# Altium schematic sheet AGV_Schematic.SchDoc
size A3
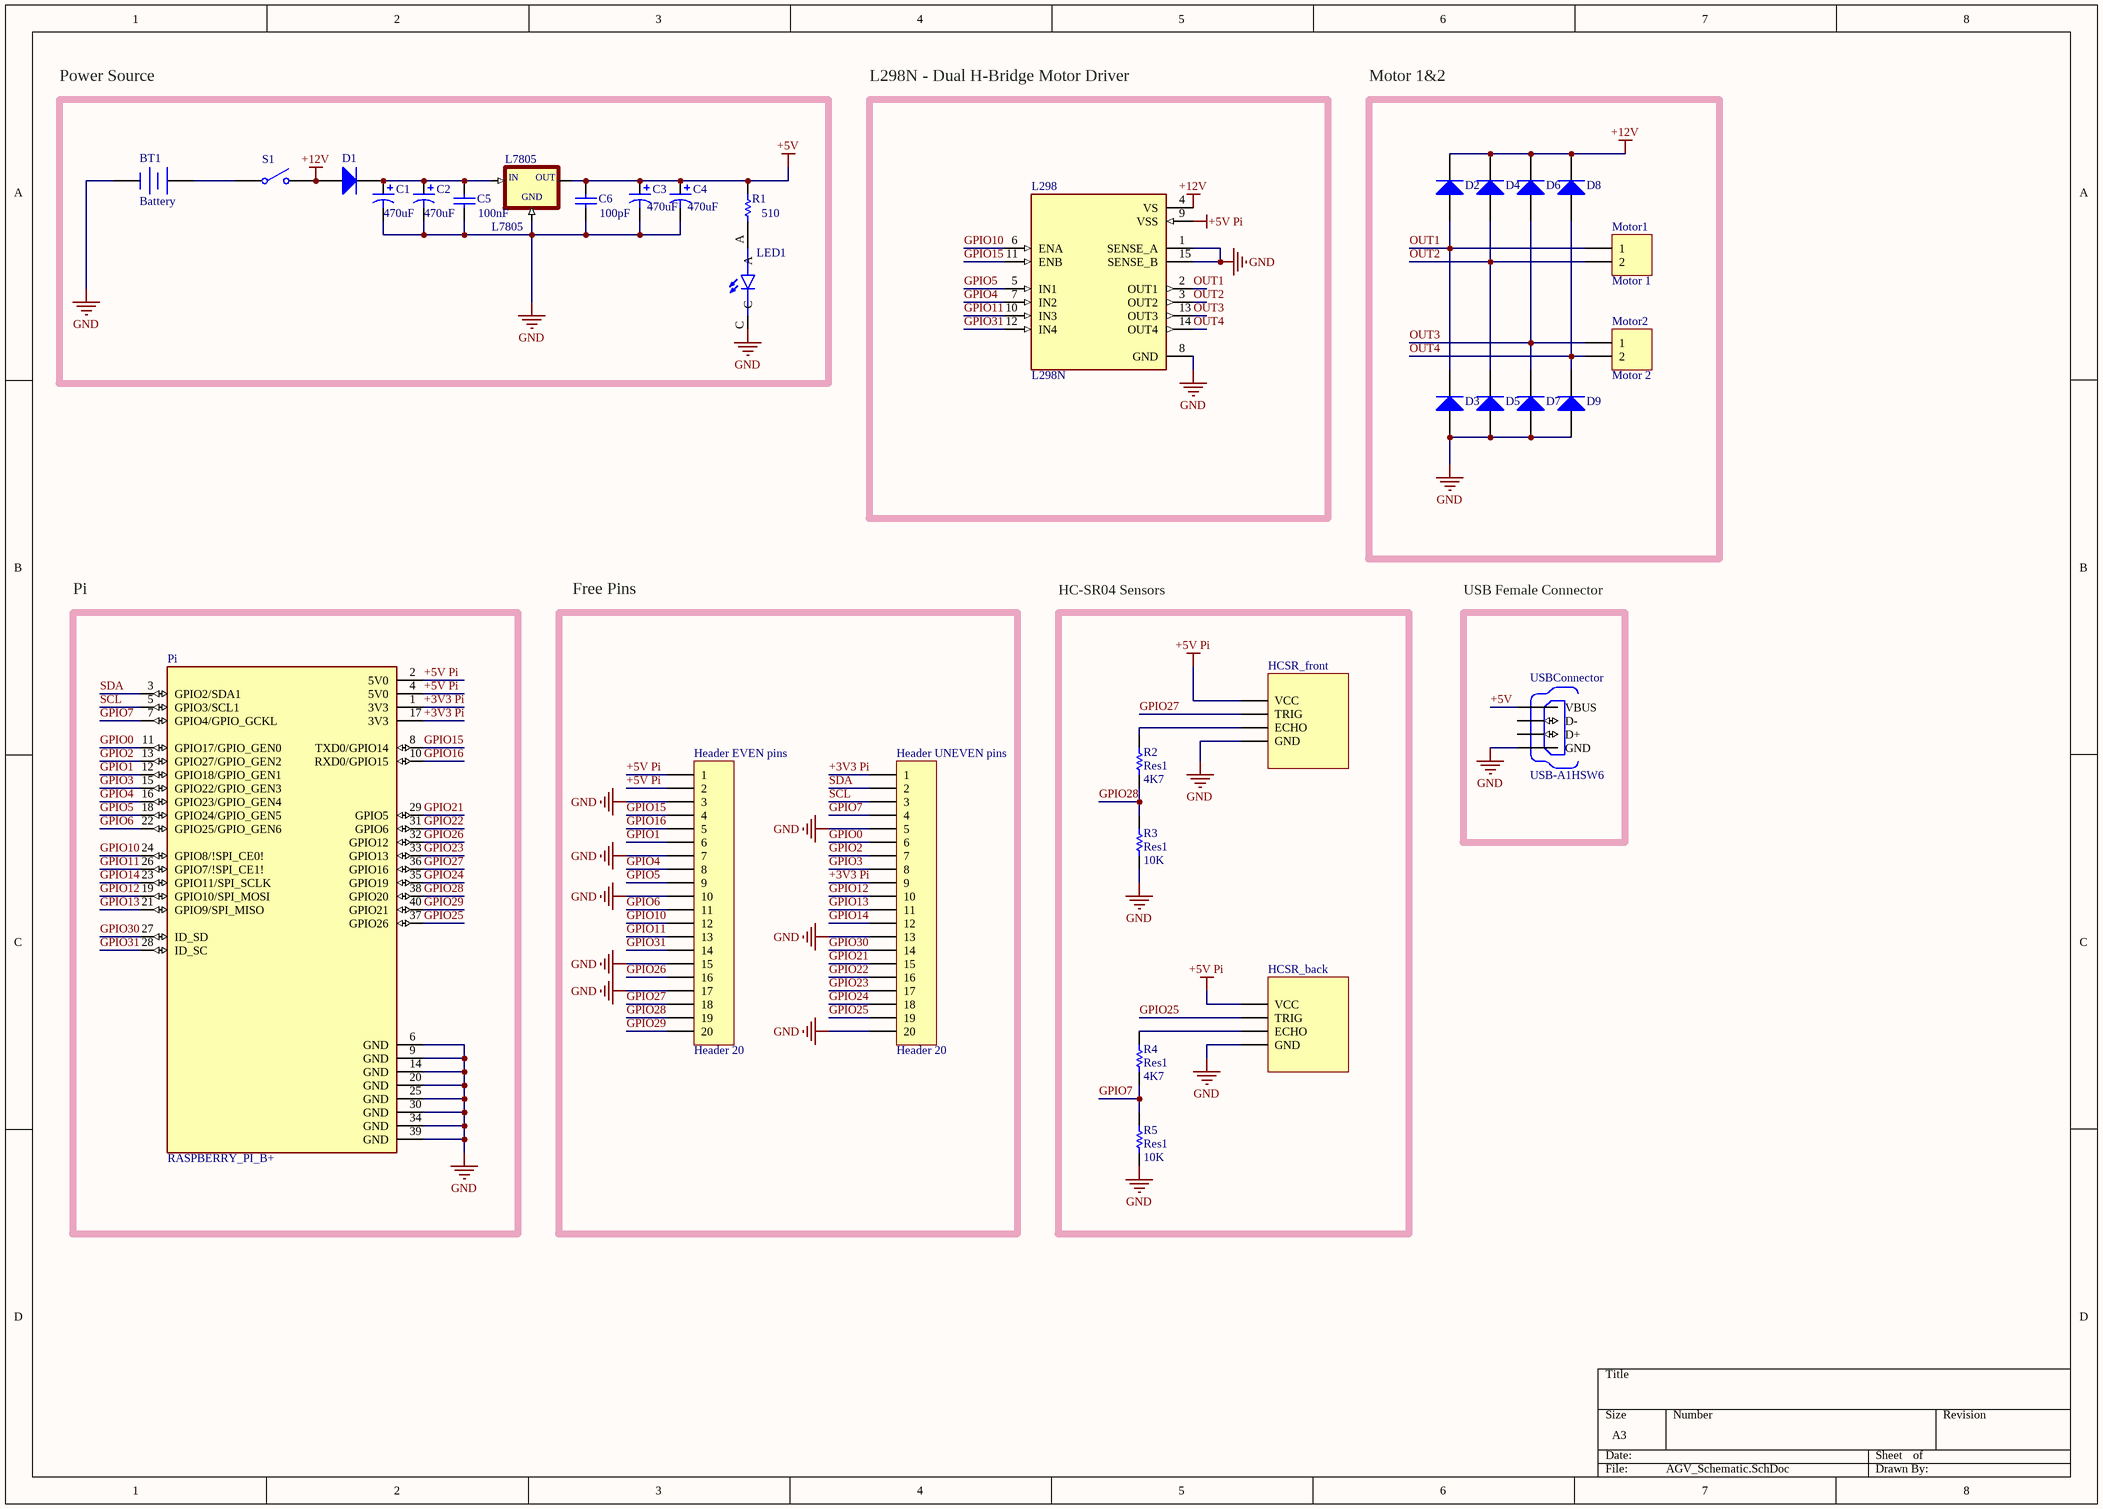
[diagram p0: AGV_Schematic.SchDoc]

## Parts
BT1  Battery  [PCBComponent_1]
C1  value 470uF  [Elektrolitski kondenzator]  (hidden comment: Cap Pol1)
C2  value 470uF  [Elektrolitski kondenzator]  (hidden comment: Cap Pol1)
C3  value 470uF  [Elektrolitski kondenzator]  (hidden comment: Cap Pol1)
C4  value 470uF  [Elektrolitski kondenzator]  (hidden comment: Cap Pol1)
C5  value 100nF  [CAP140]  (hidden comment: Cap)
C6  value 100pF  [CAP140]  (hidden comment: Cap)
D1  Diode 1N4007  [DO-41]  (value not drawn)
D2  Diode 1N5402  [DO-41]  (value not drawn)
D3  Diode 1N5402  [DO-41]  (value not drawn)
D4  Diode 1N5402  [DO-41]  (value not drawn)
D5  Diode 1N5402  [DO-41]  (value not drawn)
D6  Diode 1N5402  [DO-41]  (value not drawn)
D7  Diode 1N5402  [DO-41]  (value not drawn)
D8  Diode 1N5402  [DO-41]  (value not drawn)
D9  Diode 1N5402  [DO-41]  (value not drawn)
HCSR_back  (no value)  [HDR1X4]
HCSR_front  (no value)  [HDR1X4]
Header_EVEN_pins  Header 20  [HDR1X20]
Header_UNEVEN_pins  Header 20  [HDR1X20]
L298  L298N  [TO127P2020X500X2100-15]
L7805  L7805  [78XXS]
LED1  *  [LED_WP7113LGD]  (value not drawn)
Motor1  Motor 1  [PCBComponent_1]
Motor2  Motor 2  [PCBComponent_1]
Pi  RASPBERRY_PI_B+  [PiMirror]
R1  value 510  [AXIAL-0.3]  (hidden comment: Res1)
R2  Res1  value 4K7  [AXIAL-0.3]
R3  Res1  value 10K  [AXIAL-0.3]
R4  Res1  value 4K7  [AXIAL-0.3]
R5  Res1  value 10K  [AXIAL-0.3]
S1  SW-SPST  [Prekidac]  (value not drawn)
USBConnector  USB-A1HSW6  [OST_USB-A1HSW6]

## Blocks framed on the sheet
Power Source: BT1 C1-C6 D1 L7805 LED1 R1 S1
L298N - Dual H-Bridge Motor Driver: L298
Motor 1&2: D2-D9 Motor1 Motor2
Pi: Pi
Free Pins: Header_EVEN_pins Header_UNEVEN_pins
HC-SR04 Sensors: HCSR_back HCSR_front R2-R5
USB Female Connector: USBConnector

## Nets
+5V: C3.1 C4.1 C6.2 L7805.OUT R1.2 USBConnector.1(VBUS)
+5V Pi: HCSR_back.1(VCC) HCSR_front.1(VCC) Header_EVEN_pins.1 Header_EVEN_pins.2 L298.9(VSS) Pi.2(5V0) Pi.4(5V0)
+12V: D1.1(A) D2.2(K) D4.2(K) D6.2(K) D8.2(K) L298.4(VS) S1.2(NO)
GND: BT1.2(-) C1.2 C2.2 C3.2 C4.2 C5.1 C6.1 D3.1(A) D5.1(A) D7.1(A) D9.1(A) HCSR_back.4(GND) HCSR_front.4(GND) Header_EVEN_pins.3 Header_EVEN_pins.7 Header_EVEN_pins.10 Header_EVEN_pins.15 Header_EVEN_pins.17 Header_UNEVEN_pins.5 Header_UNEVEN_pins.13 Header_UNEVEN_pins.20 L298.1(SENSE_A) L298.8(GND) L298.15(SENSE_B) L7805.GND LED1.C Pi.6(GND) Pi.9(GND) Pi.14(GND) Pi.20(GND) Pi.25(GND) Pi.30(GND) Pi.34(GND) Pi.39(GND) R3.1 R5.1 USBConnector.4(GND)
+3V3 Pi: Header_UNEVEN_pins.1 Header_UNEVEN_pins.9 Pi.1(3V3) Pi.17(3V3)
GPIO0: Header_UNEVEN_pins.6 Pi.11(GPIO17/GPIO_GEN0)
GPIO1: Header_EVEN_pins.6 Pi.12(GPIO18/GPIO_GEN1)
GPIO2: Header_UNEVEN_pins.7 Pi.13(GPIO27/GPIO_GEN2)
GPIO3: Header_UNEVEN_pins.8 Pi.15(GPIO22/GPIO_GEN3)
GPIO4: Header_EVEN_pins.8 L298.7(IN2) Pi.16(GPIO23/GPIO_GEN4)
GPIO5: Header_EVEN_pins.9 L298.5(IN1) Pi.18(GPIO24/GPIO_GEN5)
GPIO6: Header_EVEN_pins.11 Pi.22(GPIO25/GPIO_GEN6)
GPIO7: Header_UNEVEN_pins.4 Pi.7(GPIO4/GPIO_GCKL) R4.1 R5.2
GPIO10: Header_EVEN_pins.12 L298.6(ENA) Pi.24(GPIO8/!SPI_CE0!)
GPIO11: Header_EVEN_pins.13 L298.10(IN3) Pi.26(GPIO7/!SPI_CE1!)
GPIO12: Header_UNEVEN_pins.10 Pi.19(GPIO10/SPI_MOSI)
GPIO13: Header_UNEVEN_pins.11 Pi.21(GPIO9/SPI_MISO)
GPIO14: Header_UNEVEN_pins.12 Pi.23(GPIO11/SPI_SCLK)
GPIO15: Header_EVEN_pins.4 L298.11(ENB) Pi.8(TXD0/GPIO14)
GPIO16: Header_EVEN_pins.5 Pi.10(RXD0/GPIO15)
GPIO21: Header_UNEVEN_pins.15 Pi.29(GPIO5)
GPIO22: Header_UNEVEN_pins.16 Pi.31(GPIO6)
GPIO23: Header_UNEVEN_pins.17 Pi.33(GPIO13)
GPIO24: Header_UNEVEN_pins.18 Pi.35(GPIO19)
GPIO25: HCSR_back.2(TRIG) Header_UNEVEN_pins.19 Pi.37(GPIO26)
GPIO26: Header_EVEN_pins.16 Pi.32(GPIO12)
GPIO27: HCSR_front.2(TRIG) Header_EVEN_pins.18 Pi.36(GPIO16)
GPIO28: Header_EVEN_pins.19 Pi.38(GPIO20) R2.1 R3.2
GPIO29: Header_EVEN_pins.20 Pi.40(GPIO21)
GPIO30: Header_UNEVEN_pins.14 Pi.27(ID_SD)
GPIO31: Header_EVEN_pins.14 L298.12(IN4) Pi.28(ID_SC)
OUT1: D2.1(A) D3.2(K) L298.2(OUT1) Motor1.1
OUT2: D4.1(A) D5.2(K) L298.3(OUT2) Motor1.2
OUT3: D6.1(A) D7.2(K) L298.13(OUT3) Motor2.1
OUT4: D8.1(A) D9.2(K) L298.14(OUT4) Motor2.2
SCL: Header_UNEVEN_pins.3 Pi.5(GPIO3/SCL1)
SDA: Header_UNEVEN_pins.2 Pi.3(GPIO2/SDA1)
NetBT1_1: BT1.1(+) S1.1(COMMON)
NetC1_1: C1.1 C2.1 C5.2 D1.2(K) L7805.IN
NetHCSR_back_3: HCSR_back.3(ECHO) R4.2
NetHCSR_front_3: HCSR_front.3(ECHO) R2.2
NetLED1_A: LED1.A R1.1

Not connected (* = marked no-connect by the designer): USBConnector 2(D-) 3(D+)

## Library data of the parts
BT1 = Battery: Multicell Battery; Published: 24-Mar-1999; LatestRevisionDate: 17-Jul-2002; LatestRevisionNote: Re-released for DXP Platform.; PackageReference: BAT-2; Publisher: Altium Limited; PackageDescription: Battery; 2 Leads
C1-C4 = Cap Pol1: Polarized Capacitor (Radial); Published: 8-Jun-2000; LatestRevisionDate: 17-Jul-2002; LatestRevisionNote: Re-released for DXP Platform.; PackageReference: RB7.6-15; Publisher: Altium Limited; PackageDescription: Polarized Capacitor (Radial); 2 Leads
C5 C6 = Cap: Capacitor; Published: 8-Jun-2000; LatestRevisionDate: 17-Jul-2002; LatestRevisionNote: Re-released for DXP Platform.; PackageReference: RAD-0.3; Publisher: Altium Limited; PackageDescription: Radial Cap, Thru-Hole; 2 Leads; 0.3 in Pin Spacing
D1 = Diode 1N4007: 1 Amp General Purpose Rectifier; Published: 8-Jun-2000; LatestRevisionDate: 17-Jul-2002; LatestRevisionNote: Re-released for DXP Platform.; DatasheetVersion: 1998; PackageVersion: Aug-1999; PackageReference: DO-41; Publisher: Altium Limited; PackageDescription: Diode, Axial; Body 5.2 x 2.7 mm (LxDia. max), Lead Dia. 0.86 mm (max); Code_JEDEC: DO-204-AL; ComponentLink1Description: Manufacturer Link; ComponentLink1URL: http://www.fairchildsemi.com/; ComponentLink2Description: Datasheet; ComponentLink2URL: http://www.fairchildsemi.com/ds/1N%2F1N4001.pdf
D2-D9 = Diode 1N5402: 3 Amp General Purpose Rectifier; Published: 8-Jun-2000; LatestRevisionDate: 17-Jul-2002; LatestRevisionNote: Re-released for DXP Platform.; DatasheetVersion: 1998; PackageVersion: Aug-1999; PackageReference: DO-201AD; Publisher: Altium Limited; PackageDescription: Diode, Axial; Body 9.5 x 5.6 mm (LxDia. max), Lead Dia. 1.32 mm (max); ComponentLink1Description: Manufacturer Link; ComponentLink1URL: http://www.fairchildsemi.com/; ComponentLink2Description: Datasheet; ComponentLink2URL: http://www.fairchildsemi.com/ds/1N%2F1N5400.pdf
HCSR_back HCSR_front = HC-SR04
Header_EVEN_pins Header_UNEVEN_pins = Header 20: Header, 20-Pin; LatestRevisionDate: 17-Jul-2002; LatestRevisionNote: Re-released for DXP Platform.; Publisher: Altium Limited
L298 = L298N: Dual Full Bridge Motor Driver 15-Pin(15+Tab) MULTIWATT V Tube; MP: L298N; Availability: Unavailable; Package: None; Value: *; Price: None
L7805 = L7805: Linear Voltage Regulator IC 1 Output 1.5A D2PAK; MF: STMicroelectronics; Package: TO-263-3 Inchange Semiconductor; Availability: Unavailable; MP: L7805; Value: *; SnapEDA_Link: https://www.snapeda.com/parts/L7805/STMicroelectronics/view-part/563125/?ref=snap; Price: None
LED1 = WP7113LGD: MF: Kingbright; Price: None; Availability: In Stock; Package: Radial Kingbright; MP: WP7113LGD; Value: *; SnapEDA_Link: https://www.snapeda.com/parts/WP7113LGD/Kingbright/view-part/?ref=snap; Purchase-URL: https://pricing.snapeda.com/search/part/WP7113LGD/?ref=eda; Check_prices: https://www.snapeda.com/parts/WP7113LGD/Kingbright/view-part/?ref=eda
Motor1 Motor2 = Header 2: Header, 2-Pin; LatestRevisionDate: 17-Jul-2002; LatestRevisionNote: Re-released for DXP Platform.; Publisher: Altium Limited
Pi = RASPBERRY_PI_B+: BCM2835 Raspberry Pi Model B+ - ARM11, VideoCore MPU Embedded Evaluation Board; MP: RASPBERRY PI B+; Price: None; Value: *; MF: Raspberry Pi; Package: None; SnapEDA_Link: https://www.snapeda.com/parts/RASPBERRY%20PI%20B+/Raspberry%20Pi/view-part/559759/?ref=snap; Availability: Unavailable; BuyPart: https://www.snapeda.com/parts/RASPBERRY%20PI%20B+/Raspberry%20Pi/view-part/559759/?ref=eda
R1-R5 = Res1: Resistor; Published: 8-Jun-2000; LatestRevisionDate: 17-Jul-2002; LatestRevisionNote: Re-released for DXP Platform.; PackageReference: AXIAL-0.3; Publisher: Altium Limited; PackageDescription: Axial Device, Thru-Hole; 2 Leads; 0.3 in Pin Spacing
S1 = SW-SPST: Single-Pole, Single-Throw Switch; Published: 24-Mar-1999; LatestRevisionDate: 17-Jul-2002; LatestRevisionNote: Re-released for DXP Platform.; PackageReference: SPST-2; Publisher: Altium Limited; PackageDescription: Switch; 2 Leads
USBConnector = USB-A1HSW6: USB-A (USB TYPE-A) - Receptacle Connector 4 Position Through Hole, Right Angle; MF: On Shore; Value: *; SnapEDA_Link: https://www.snapeda.com/parts/USB-A1HSW6/On+Shore+Technology+Inc./view-part/?ref=snap; Purchase-URL: https://pricing.snapeda.com/search/part/USB-A1HSW6/?ref=eda; Availability: In Stock; Price: None; Package: None; Check_prices: https://www.snapeda.com/parts/USB-A1HSW6/On+Shore+Technology+Inc./view-part/?ref=eda; MP: USB-A1HSW6